# Altium schematic sheet [09] - FPGA IO BANK 2A, 2L.SchDoc
size A3; DocumentNumber: 9; SheetNumber: 9; SheetTotal: 15
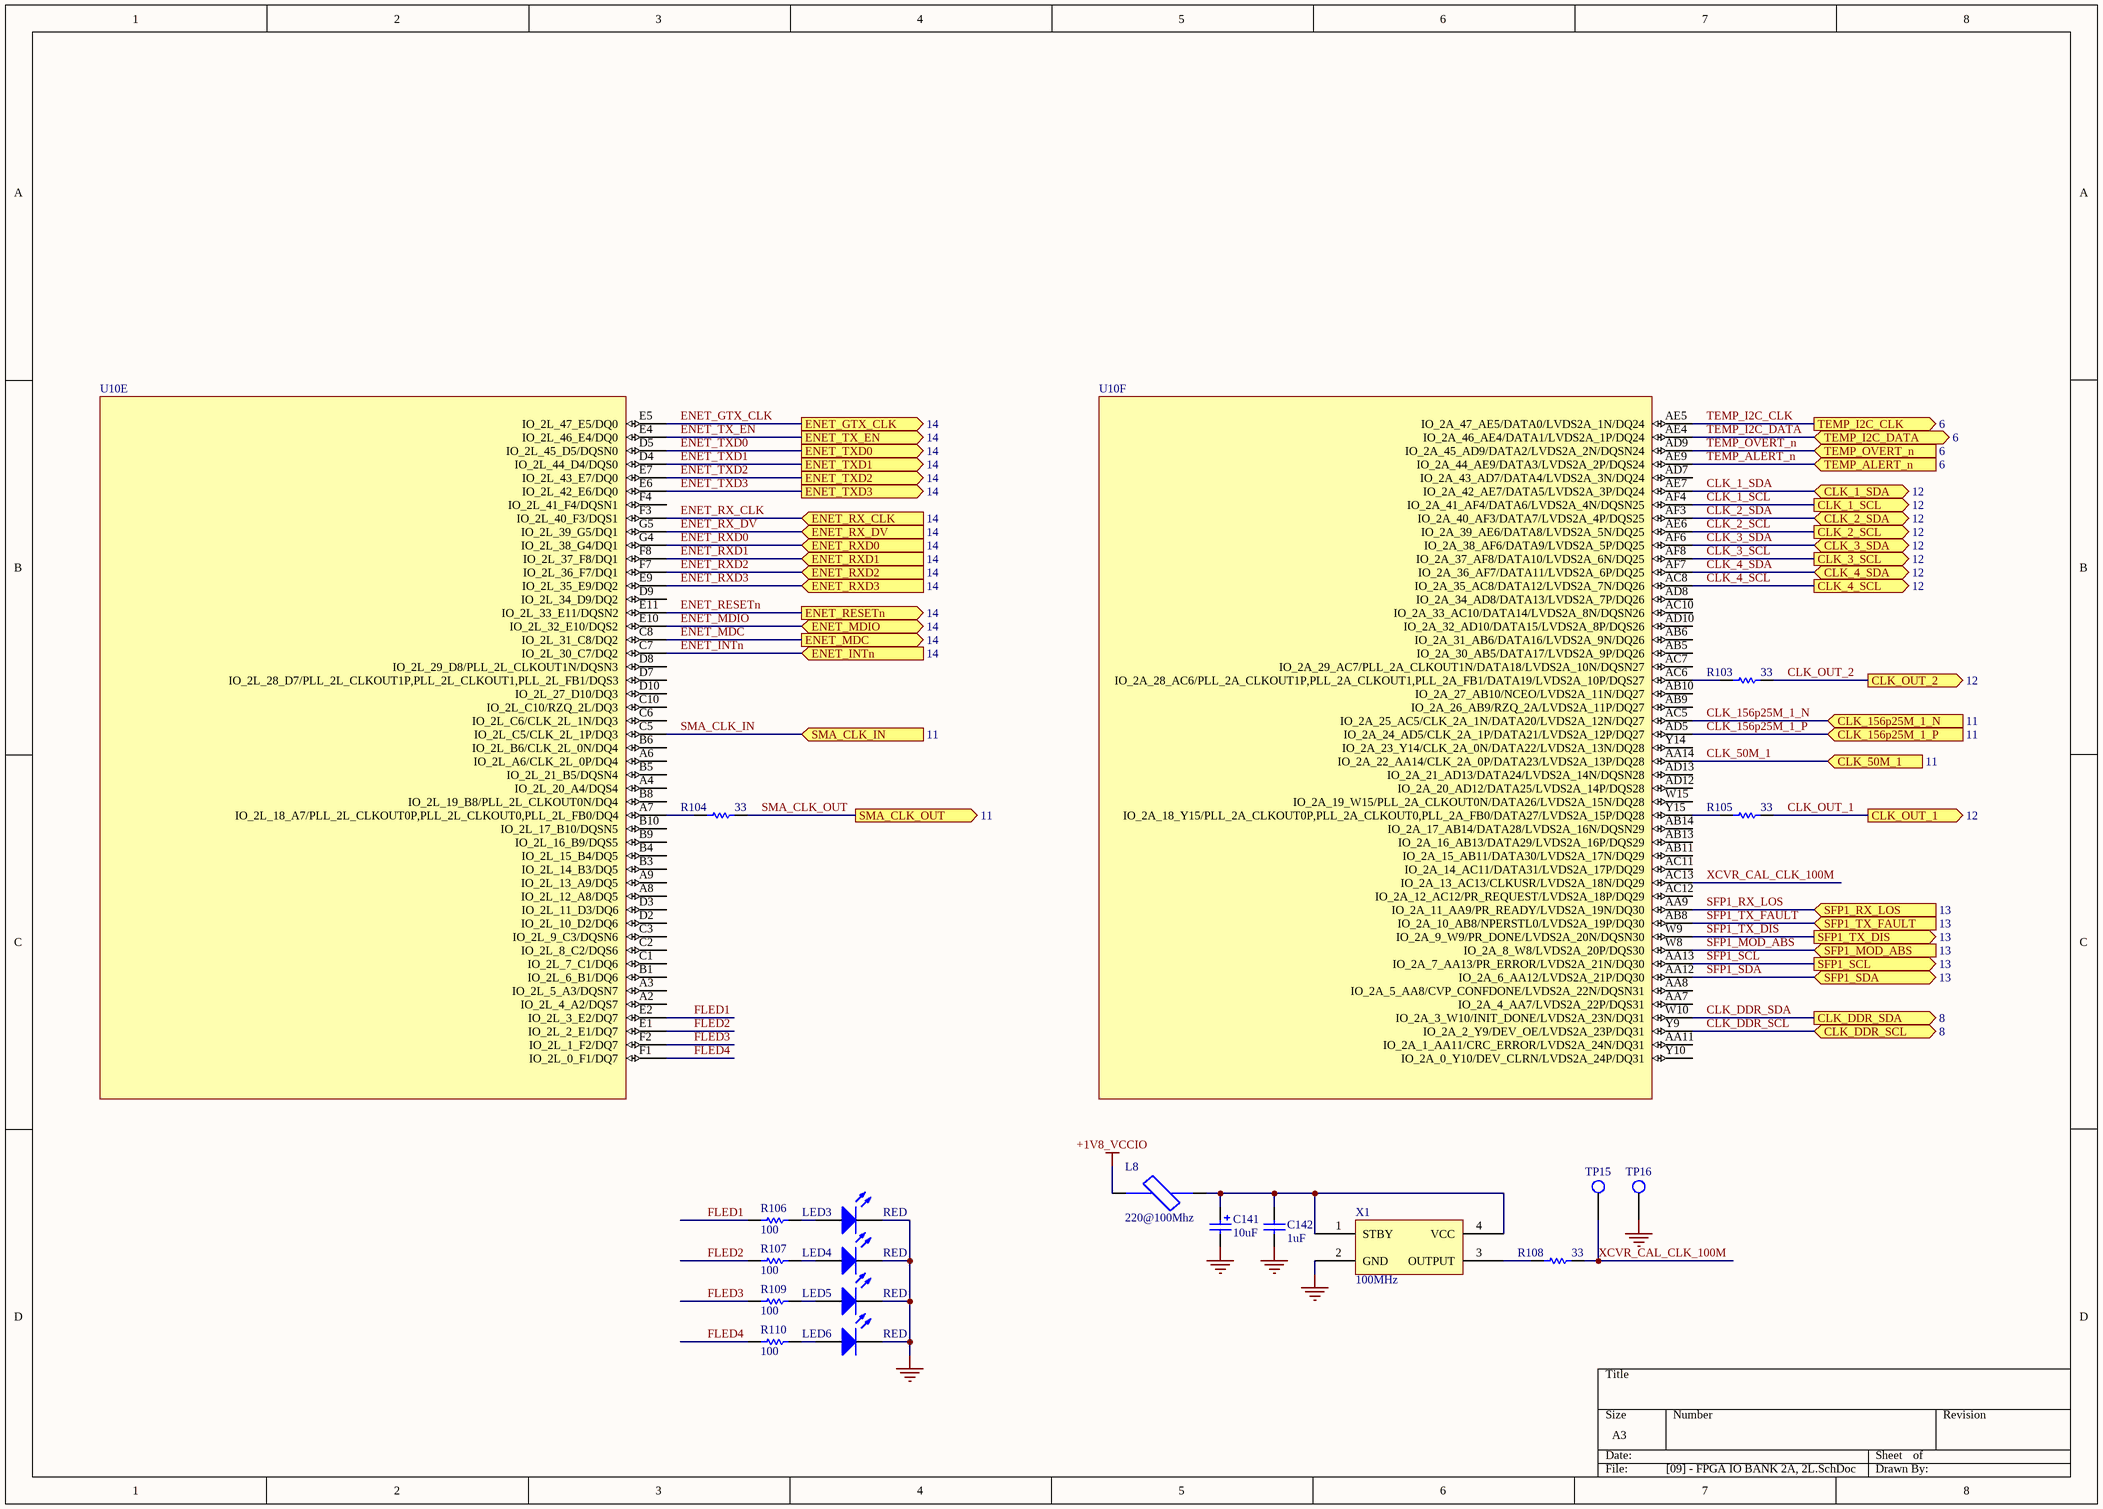
[diagram p0: [09] - FPGA IO BANK 2A, 2L.SchDoc]

## Parts
C141  10uF  [TANT_B]
C142  1uF  [0402_C]
L8  220@100Mhz  [0805_L]
LED3  RED  [LED_0805]
LED4  RED  [LED_0805]
LED5  RED  [LED_0805]
LED6  RED  [LED_0805]
R103  33  [0402_R]
R104  33  [0402_R]
R105  33  [0402_R]
R106  100  [0805_R]
R107  100  [0805_R]
R108  33  [0402_R]
R109  100  [0805_R]
R110  100  [0805_R]
TP15  Test Point  [PIN_1mm]  (value not drawn)
TP16  Test Point  [PIN_1mm]  (value not drawn)
U10  10AX016 F27  [FBGA672]  (value not drawn)  (parts E,F of 12)
X1  100MHz  [OSC_5X3.2]

## Ports
CLK_1_SCL (out, see 12), CLK_1_SDA (bidir, see 12), CLK_2_SCL (out, see 12), CLK_2_SDA (bidir, see 12), CLK_3_SCL (out, see 12), CLK_3_SDA (bidir, see 12), CLK_4_SCL (out, see 12), CLK_4_SDA (bidir, see 12), CLK_50M_1 (in, see 11), CLK_156p25M_1_N (in, see 11), CLK_156p25M_1_P (in, see 11), CLK_DDR_SCL (bidir, see 8), CLK_DDR_SDA (out, see 8), CLK_OUT_1 (out, see 12), CLK_OUT_2 (out, see 12), ENET_GTX_CLK (out, see 14), ENET_INTn (in, see 14), ENET_MDC (out, see 14), ENET_MDIO (bidir, see 14), ENET_RESETn (out, see 14), ENET_RX_CLK (in, see 14), ENET_RX_DV (in, see 14), ENET_RXD0 (in, see 14), ENET_RXD1 (in, see 14), ENET_RXD2 (in, see 14), ENET_RXD3 (in, see 14), ENET_TX_EN (out, see 14), ENET_TXD0 (out, see 14), ENET_TXD1 (out, see 14), ENET_TXD2 (out, see 14), ENET_TXD3 (out, see 14), SFP1_MOD_ABS (in, see 13), SFP1_RX_LOS (in, see 13), SFP1_SCL (out, see 13), SFP1_SDA (bidir, see 13), SFP1_TX_DIS (out, see 13), SFP1_TX_FAULT (in, see 13), SMA_CLK_IN (in, see 11), SMA_CLK_OUT (out, see 11), TEMP_ALERT_n (in, see 6), TEMP_I2C_CLK (out, see 6), TEMP_I2C_DATA (bidir, see 6), TEMP_OVERT_n (in, see 6)

## Nets
+1V8_VCCIO: L8.1
GND: C141.2 C142.1 LED3.2(K) LED4.2(K) LED5.2(K) LED6.2(K) TP16.1 X1.2(GND)
CLK_1_SCL: U10.AF4(IO_2A_41_AF4/DATA6/LVDS2A_4N/DQSN25) ; port CLK_1_SCL
CLK_1_SDA: U10.AE7(IO_2A_42_AE7/DATA5/LVDS2A_3P/DQ24) ; port CLK_1_SDA
CLK_2_SCL: U10.AE6(IO_2A_39_AE6/DATA8/LVDS2A_5N/DQ25) ; port CLK_2_SCL
CLK_2_SDA: U10.AF3(IO_2A_40_AF3/DATA7/LVDS2A_4P/DQS25) ; port CLK_2_SDA
CLK_3_SCL: U10.AF8(IO_2A_37_AF8/DATA10/LVDS2A_6N/DQ25) ; port CLK_3_SCL
CLK_3_SDA: U10.AF6(IO_2A_38_AF6/DATA9/LVDS2A_5P/DQ25) ; port CLK_3_SDA
CLK_4_SCL: U10.AC8(IO_2A_35_AC8/DATA12/LVDS2A_7N/DQ26) ; port CLK_4_SCL
CLK_4_SDA: U10.AF7(IO_2A_36_AF7/DATA11/LVDS2A_6P/DQ25) ; port CLK_4_SDA
CLK_50M_1: U10.AA14(IO_2A_22_AA14/CLK_2A_0P/DATA23/LVDS2A_13P/DQ28) ; port CLK_50M_1
CLK_156p25M_1_N: U10.AC5(IO_2A_25_AC5/CLK_2A_1N/DATA20/LVDS2A_12N/DQ27) ; port CLK_156p25M_1_N
CLK_156p25M_1_P: U10.AD5(IO_2A_24_AD5/CLK_2A_1P/DATA21/LVDS2A_12P/DQ27) ; port CLK_156p25M_1_P
CLK_DDR_SCL: U10.Y9(IO_2A_2_Y9/DEV_OE/LVDS2A_23P/DQ31) ; port CLK_DDR_SCL
CLK_DDR_SDA: U10.W10(IO_2A_3_W10/INIT_DONE/LVDS2A_23N/DQ31) ; port CLK_DDR_SDA
CLK_OUT_1: R105.2 ; port CLK_OUT_1
CLK_OUT_2: R103.2 ; port CLK_OUT_2
ENET_GTX_CLK: U10.E5(IO_2L_47_E5/DQ0) ; port ENET_GTX_CLK
ENET_INTn: U10.C7(IO_2L_30_C7/DQ2) ; port ENET_INTn
ENET_MDC: U10.C8(IO_2L_31_C8/DQ2) ; port ENET_MDC
ENET_MDIO: U10.E10(IO_2L_32_E10/DQS2) ; port ENET_MDIO
ENET_RESETn: U10.E11(IO_2L_33_E11/DQSN2) ; port ENET_RESETn
ENET_RX_CLK: U10.F3(IO_2L_40_F3/DQS1) ; port ENET_RX_CLK
ENET_RX_DV: U10.G5(IO_2L_39_G5/DQ1) ; port ENET_RX_DV
ENET_RXD0: U10.G4(IO_2L_38_G4/DQ1) ; port ENET_RXD0
ENET_RXD1: U10.F8(IO_2L_37_F8/DQ1) ; port ENET_RXD1
ENET_RXD2: U10.F7(IO_2L_36_F7/DQ1) ; port ENET_RXD2
ENET_RXD3: U10.E9(IO_2L_35_E9/DQ2) ; port ENET_RXD3
ENET_TX_EN: U10.E4(IO_2L_46_E4/DQ0) ; port ENET_TX_EN
ENET_TXD0: U10.D5(IO_2L_45_D5/DQSN0) ; port ENET_TXD0
ENET_TXD1: U10.D4(IO_2L_44_D4/DQS0) ; port ENET_TXD1
ENET_TXD2: U10.E7(IO_2L_43_E7/DQ0) ; port ENET_TXD2
ENET_TXD3: U10.E6(IO_2L_42_E6/DQ0) ; port ENET_TXD3
FLED1: R106.2 U10.E2(IO_2L_3_E2/DQ7)
FLED2: R107.2 U10.E1(IO_2L_2_E1/DQ7)
FLED3: R109.2 U10.F2(IO_2L_1_F2/DQ7)
FLED4: R110.2 U10.F1(IO_2L_0_F1/DQ7)
SFP1_MOD_ABS: U10.W8(IO_2A_8_W8/LVDS2A_20P/DQS30) ; port SFP1_MOD_ABS
SFP1_RX_LOS: U10.AA9(IO_2A_11_AA9/PR_READY/LVDS2A_19N/DQ30) ; port SFP1_RX_LOS
SFP1_SCL: U10.AA13(IO_2A_7_AA13/PR_ERROR/LVDS2A_21N/DQ30) ; port SFP1_SCL
SFP1_SDA: U10.AA12(IO_2A_6_AA12/LVDS2A_21P/DQ30) ; port SFP1_SDA
SFP1_TX_DIS: U10.W9(IO_2A_9_W9/PR_DONE/LVDS2A_20N/DQSN30) ; port SFP1_TX_DIS
SFP1_TX_FAULT: U10.AB8(IO_2A_10_AB8/NPERSTL0/LVDS2A_19P/DQ30) ; port SFP1_TX_FAULT
SMA_CLK_IN: U10.C5(IO_2L_C5/CLK_2L_1P/DQ3) ; port SMA_CLK_IN
SMA_CLK_OUT: R104.2 ; port SMA_CLK_OUT
TEMP_ALERT_n: U10.AE9(IO_2A_44_AE9/DATA3/LVDS2A_2P/DQS24) ; port TEMP_ALERT_n
TEMP_I2C_CLK: U10.AE5(IO_2A_47_AE5/DATA0/LVDS2A_1N/DQ24) ; port TEMP_I2C_CLK
TEMP_I2C_DATA: U10.AE4(IO_2A_46_AE4/DATA1/LVDS2A_1P/DQ24) ; port TEMP_I2C_DATA
TEMP_OVERT_n: U10.AD9(IO_2A_45_AD9/DATA2/LVDS2A_2N/DQSN24) ; port TEMP_OVERT_n
XCVR_CAL_CLK_100M: R108.2 TP15.1 U10.AC13(IO_2A_13_AC13/CLKUSR/LVDS2A_18N/DQ29)
NetC141_1: C141.1 C142.2 L8.2 X1.1(STBY) X1.4(VCC)
NetLED3_1: LED3.1(A) R106.1
NetLED4_1: LED4.1(A) R107.1
NetLED5_1: LED5.1(A) R109.1
NetLED6_1: LED6.1(A) R110.1
NetR103_1: R103.1 U10.AC6(IO_2A_28_AC6/PLL_2A_CLKOUT1P,PLL_2A_CLKOUT1,PLL_2A_FB1/DATA19/LVDS2A_10P/DQS27)
NetR104_1: R104.1 U10.A7(IO_2L_18_A7/PLL_2L_CLKOUT0P,PLL_2L_CLKOUT0,PLL_2L_FB0/DQ4)
NetR105_1: R105.1 U10.Y15(IO_2A_18_Y15/PLL_2A_CLKOUT0P,PLL_2A_CLKOUT0,PLL_2A_FB0/DATA27/LVDS2A_15P/DQ28)
NetR108_1: R108.1 X1.3(OUTPUT)

Not connected (* = marked no-connect by the designer): U10 A2(IO_2L_4_A2/DQS7) A3(IO_2L_5_A3/DQSN7) A4(IO_2L_20_A4/DQS4) A6(IO_2L_A6/CLK_2L_0P/DQ4) A8(IO_2L_12_A8/DQ5) A9(IO_2L_13_A9/DQ5) AA7(IO_2A_4_AA7/LVDS2A_22P/DQS31) AA8(IO_2A_5_AA8/CVP_CONFDONE/LVDS2A_22N/DQSN31) AA11(IO_2A_1_AA11/CRC_ERROR/LVDS2A_24N/DQ31) AB5(IO_2A_30_AB5/DATA17/LVDS2A_9P/DQ26) AB6(IO_2A_31_AB6/DATA16/LVDS2A_9N/DQ26) AB9(IO_2A_26_AB9/RZQ_2A/LVDS2A_11P/DQ27) AB10(IO_2A_27_AB10/NCEO/LVDS2A_11N/DQ27) AB11(IO_2A_15_AB11/DATA30/LVDS2A_17N/DQ29) AB13(IO_2A_16_AB13/DATA29/LVDS2A_16P/DQS29) AB14(IO_2A_17_AB14/DATA28/LVDS2A_16N/DQSN29) AC7(IO_2A_29_AC7/PLL_2A_CLKOUT1N/DATA18/LVDS2A_10N/DQSN27) AC10(IO_2A_33_AC10/DATA14/LVDS2A_8N/DQSN26) AC11(IO_2A_14_AC11/DATA31/LVDS2A_17P/DQ29) AC12(IO_2A_12_AC12/PR_REQUEST/LVDS2A_18P/DQ29) AD7(IO_2A_43_AD7/DATA4/LVDS2A_3N/DQ24) AD8(IO_2A_34_AD8/DATA13/LVDS2A_7P/DQ26) AD10(IO_2A_32_AD10/DATA15/LVDS2A_8P/DQS26) AD12(IO_2A_20_AD12/DATA25/LVDS2A_14P/DQS28) AD13(IO_2A_21_AD13/DATA24/LVDS2A_14N/DQSN28) B1(IO_2L_6_B1/DQ6) B3(IO_2L_14_B3/DQ5) B4(IO_2L_15_B4/DQ5) B5(IO_2L_21_B5/DQSN4) B6(IO_2L_B6/CLK_2L_0N/DQ4) B8(IO_2L_19_B8/PLL_2L_CLKOUT0N/DQ4) B9(IO_2L_16_B9/DQS5) B10(IO_2L_17_B10/DQSN5) C1(IO_2L_7_C1/DQ6) C2(IO_2L_8_C2/DQS6) C3(IO_2L_9_C3/DQSN6) C6(IO_2L_C6/CLK_2L_1N/DQ3) C10(IO_2L_C10/RZQ_2L/DQ3) D2(IO_2L_10_D2/DQ6) D3(IO_2L_11_D3/DQ6) D7(IO_2L_28_D7/PLL_2L_CLKOUT1P,PLL_2L_CLKOUT1,PLL_2L_FB1/DQS3) D8(IO_2L_29_D8/PLL_2L_CLKOUT1N/DQSN3) D9(IO_2L_34_D9/DQ2) D10(IO_2L_27_D10/DQ3) F4(IO_2L_41_F4/DQSN1) W15(IO_2A_19_W15/PLL_2A_CLKOUT0N/DATA26/LVDS2A_15N/DQ28) Y10(IO_2A_0_Y10/DEV_CLRN/LVDS2A_24P/DQ31) Y14(IO_2A_23_Y14/CLK_2A_0N/DATA22/LVDS2A_13N/DQ28)

## Library data of the parts
C141 = Cap Tant: Tantalum Polarized Capacitor; RATED_VOLTAGE: 6.3V; Value: 10uF
C142 = Cap SMD: Non-Pol SMD Capacitor; RATED_VOLTAGE: 16V; Value: 1uF; Manufacturer Part Num: *; Dielectric: *
L8 = Ferrite Bead: Value: 220@100Mhz
LED3-LED6 = LED: Typical LED; Value: RED
R103-R110 = Res SMD: SMD Resistor; Tolerance: 5%; Manufacturer Part Num: *
  R103-R105 R108: Value: 33
  R106 R107 R109 R110: Value: 100
TP15 TP16 = Test Point: Test Point Footprint; Value: Test Point
U10 = 10AX016: Value: 10AX016 F27; Manufacturer Part Num: *
X1 = XTAL OSC: Crystal Oscillator; Manufacturer Part Num: ECS-3518-1000-B-TR; Value: 100MHz